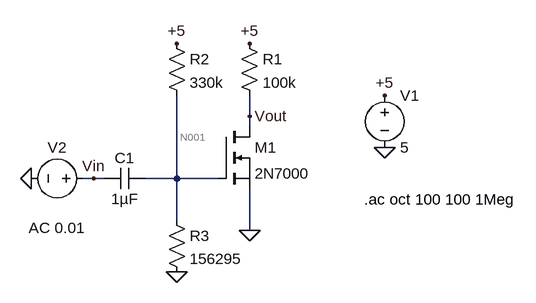
[diagram p0: schematic Draft1.asc]
Draft1.asc, the LTspice schematic file:
Version 4
SHEET 1 880 680
WIRE 160 48 160 16
WIRE 160 64 160 48
WIRE -80 144 -96 144
WIRE -64 144 -80 144
WIRE 48 144 48 16
WIRE 48 144 0 144
WIRE 112 144 48 144
WIRE 48 208 48 144
WIRE 160 224 160 160
FLAG 48 288 0
FLAG 160 224 0
FLAG 368 16 +5
FLAG 160 -64 +5
FLAG 48 -64 +5
FLAG -176 144 0
FLAG 368 96 0
FLAG -80 144 Vin
FLAG 160 48 Vout
SYMBOL res 144 -80 R0
SYMATTR InstName R1
SYMATTR Value 100k
SYMBOL res 32 -80 R0
SYMATTR InstName R2
SYMATTR Value 330k
SYMBOL res 32 192 R0
SYMATTR InstName R3
SYMATTR Value 156295
SYMBOL voltage 368 0 R0
WINDOW 123 0 0 Left 0
WINDOW 39 0 0 Left 0
SYMATTR InstName V1
SYMATTR Value 5
SYMBOL voltage -80 144 R90
WINDOW 0 -32 56 VBottom 2
WINDOW 3 32 56 VTop 2
WINDOW 123 60 56 VTop 2
WINDOW 39 0 0 Left 0
SYMATTR InstName V2
SYMATTR Value ""
SYMATTR Value2 AC 0.01
SYMBOL cap 0 128 R90
WINDOW 0 0 32 VBottom 2
WINDOW 3 32 32 VTop 2
SYMATTR InstName C1
SYMATTR Value 1µF
SYMBOL nmos 112 64 R0
SYMATTR InstName M1
SYMATTR Value 2N7000
TEXT 336 176 Left 2 !.ac oct 100 100 1Meg

The netlist it stands for:
* Draft1.asc
R1 +5 Vout 100k
R2 +5 N001 330k
R3 N001 0 156295
V1 +5 0 5
V2 Vin 0 AC 0.01
C1 N001 Vin 1µF
M1 Vout N001 0 0 2N7000
.model NMOS NMOS
.model PMOS PMOS
.lib standard.mos
.ac oct 100 100 1Meg
.backanno
.end

* Results of the author's LTspice run, read from the files saved beside the schematic
* Operating Point, zero values left out:
*   V(+5) = 5 V
*   V(vout) = 2.262 V
*   V(n001) = 1.607 V
*   Id(M1) = 27.38 µA
*   Ig(M1) = -38.2 pA
*   Is(M1) = -27.38 µA
*   I(R1) = 27.38 µA
*   I(R2) = 10.28 µA
*   I(R3) = 10.28 µA
*   I(V1) = -37.66 µA
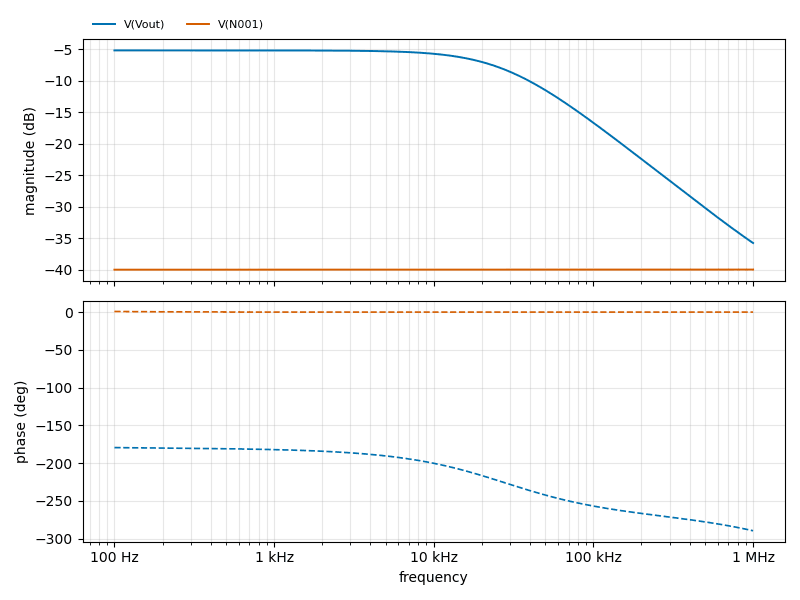
[diagram p1: AC Analysis of Draft1.asc, plotted from the saved traces]
* AC Analysis, 1 run:
*   V(Vout): -5.19 dB at 100 Hz, -35.79 dB at 1 MHz, peak -5.19 dB at 202.8 Hz, 3 dB below the peak at 27.6 kHz
*   V(N001): -40.02 dB at 100 Hz, -40.00 dB at 1 MHz, peak -40.00 dB at 1 MHz